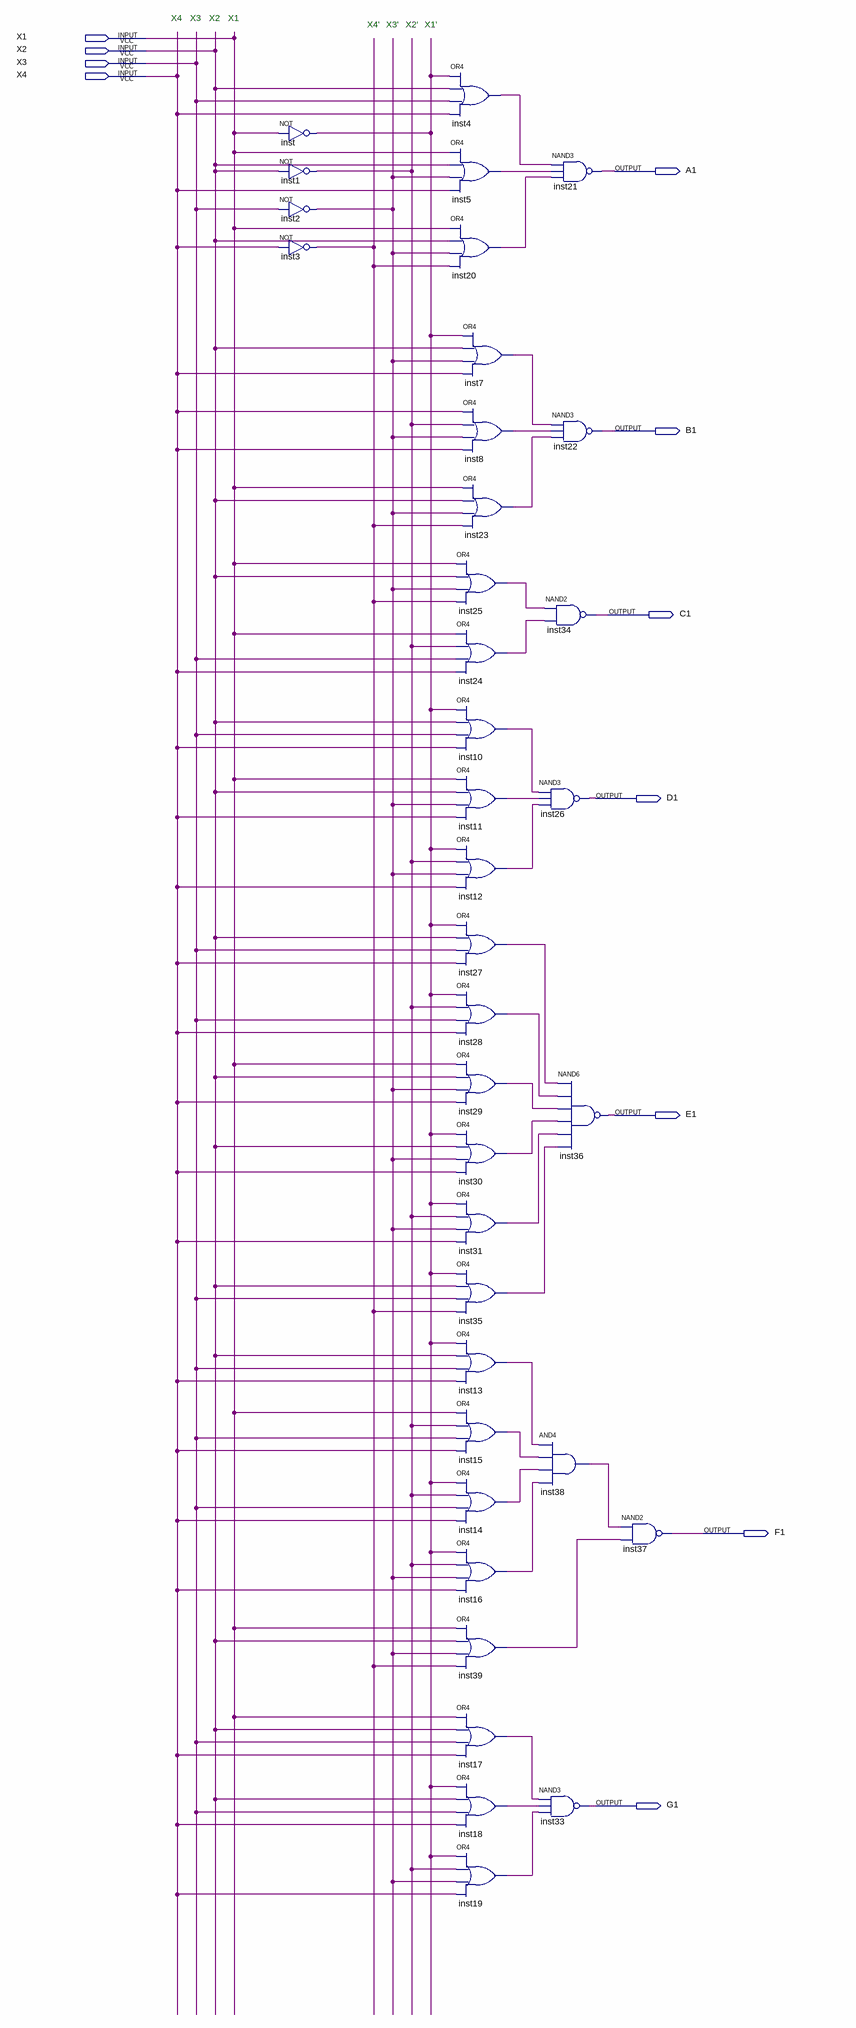
[diagram p0: schematic sheet]
// Quartus schematic Indicator1.bdf as structural Verilog: 37 symbols, 11 pins
module Indicator1 (
  input  X1,
  input  X2,
  input  X3,
  input  X4,
  output A1,
  output B1,
  output C1,
  output D1,
  output E1,
  output F1,
  output G1
);

  wire inst1_out, inst2_out, inst3_out, inst4_out, inst5_out, inst7_out, inst8_out, inst10_out, inst11_out,
       inst12_out, inst13_out, inst14_out, inst15_out, inst16_out, inst17_out, inst18_out, inst19_out,
       inst20_out, inst23_out, inst24_out, inst25_out, inst27_out, inst28_out, inst29_out, inst30_out,
       inst31_out, inst35_out, inst38_out, inst39_out, inst_out;

  not inst (inst_out, X1);
  not inst1 (inst1_out, X2);
  not inst2 (inst2_out, X3);
  not inst3 (inst3_out, X4);
  or inst4 (inst4_out, inst_out, X2, X3, X4);
  or inst5 (inst5_out, X1, X2, inst2_out, X4);
  or inst20 (inst20_out, X1, X2, inst2_out, inst3_out);
  or inst7 (inst7_out, inst_out, X2, inst2_out, X4);
  or inst8 (inst8_out, X4, inst1_out, inst2_out, X4);
  or inst23 (inst23_out, X1, X2, inst2_out, inst3_out);
  or inst25 (inst25_out, X1, X2, inst2_out, inst3_out);
  or inst24 (inst24_out, X1, inst1_out, X3, X4);
  or inst10 (inst10_out, inst_out, X2, X3, X4);
  or inst11 (inst11_out, X1, X2, inst2_out, X4);
  or inst12 (inst12_out, inst_out, inst1_out, inst2_out, X4);
  or inst27 (inst27_out, inst_out, X2, X3, X4);
  or inst28 (inst28_out, inst_out, inst1_out, X3, X4);
  or inst29 (inst29_out, X1, X2, inst2_out, X4);
  or inst30 (inst30_out, inst_out, X2, inst2_out, X4);
  or inst31 (inst31_out, inst_out, inst1_out, inst2_out, X4);
  or inst35 (inst35_out, inst_out, X2, X3, inst3_out);
  or inst13 (inst13_out, inst_out, X2, X3, X4);
  or inst15 (inst15_out, X1, inst1_out, X3, X4);
  or inst14 (inst14_out, inst_out, inst1_out, X3, X4);
  or inst16 (inst16_out, inst_out, inst1_out, inst2_out, X4);
  or inst39 (inst39_out, X1, X2, inst2_out, inst3_out);
  or inst17 (inst17_out, X1, X2, X3, X4);
  or inst18 (inst18_out, inst_out, X2, X3, X4);
  or inst19 (inst19_out, inst_out, inst1_out, inst2_out, X4);
  nand inst21 (A1, inst4_out, inst5_out, inst20_out);
  nand inst22 (B1, inst7_out, inst8_out, inst23_out);
  nand inst34 (C1, inst25_out, inst24_out);
  nand inst26 (D1, inst10_out, inst11_out, inst12_out);
  nand inst36 (E1, inst27_out, inst28_out, inst29_out, inst30_out, inst31_out, inst35_out);
  and inst38 (inst38_out, inst13_out, inst15_out, inst14_out, inst16_out);
  nand inst33 (G1, inst17_out, inst18_out, inst19_out);
  nand inst37 (F1, inst38_out, inst39_out);

  // Notes on the sheet:
  //   X4
  //   X3
  //   X2
  //   X1
  //   X4'
  //   X3'
  //   X2'
  //   X1'
endmodule
